# EAGLE design hd-gs-alt (EAGLE 9.6.2)
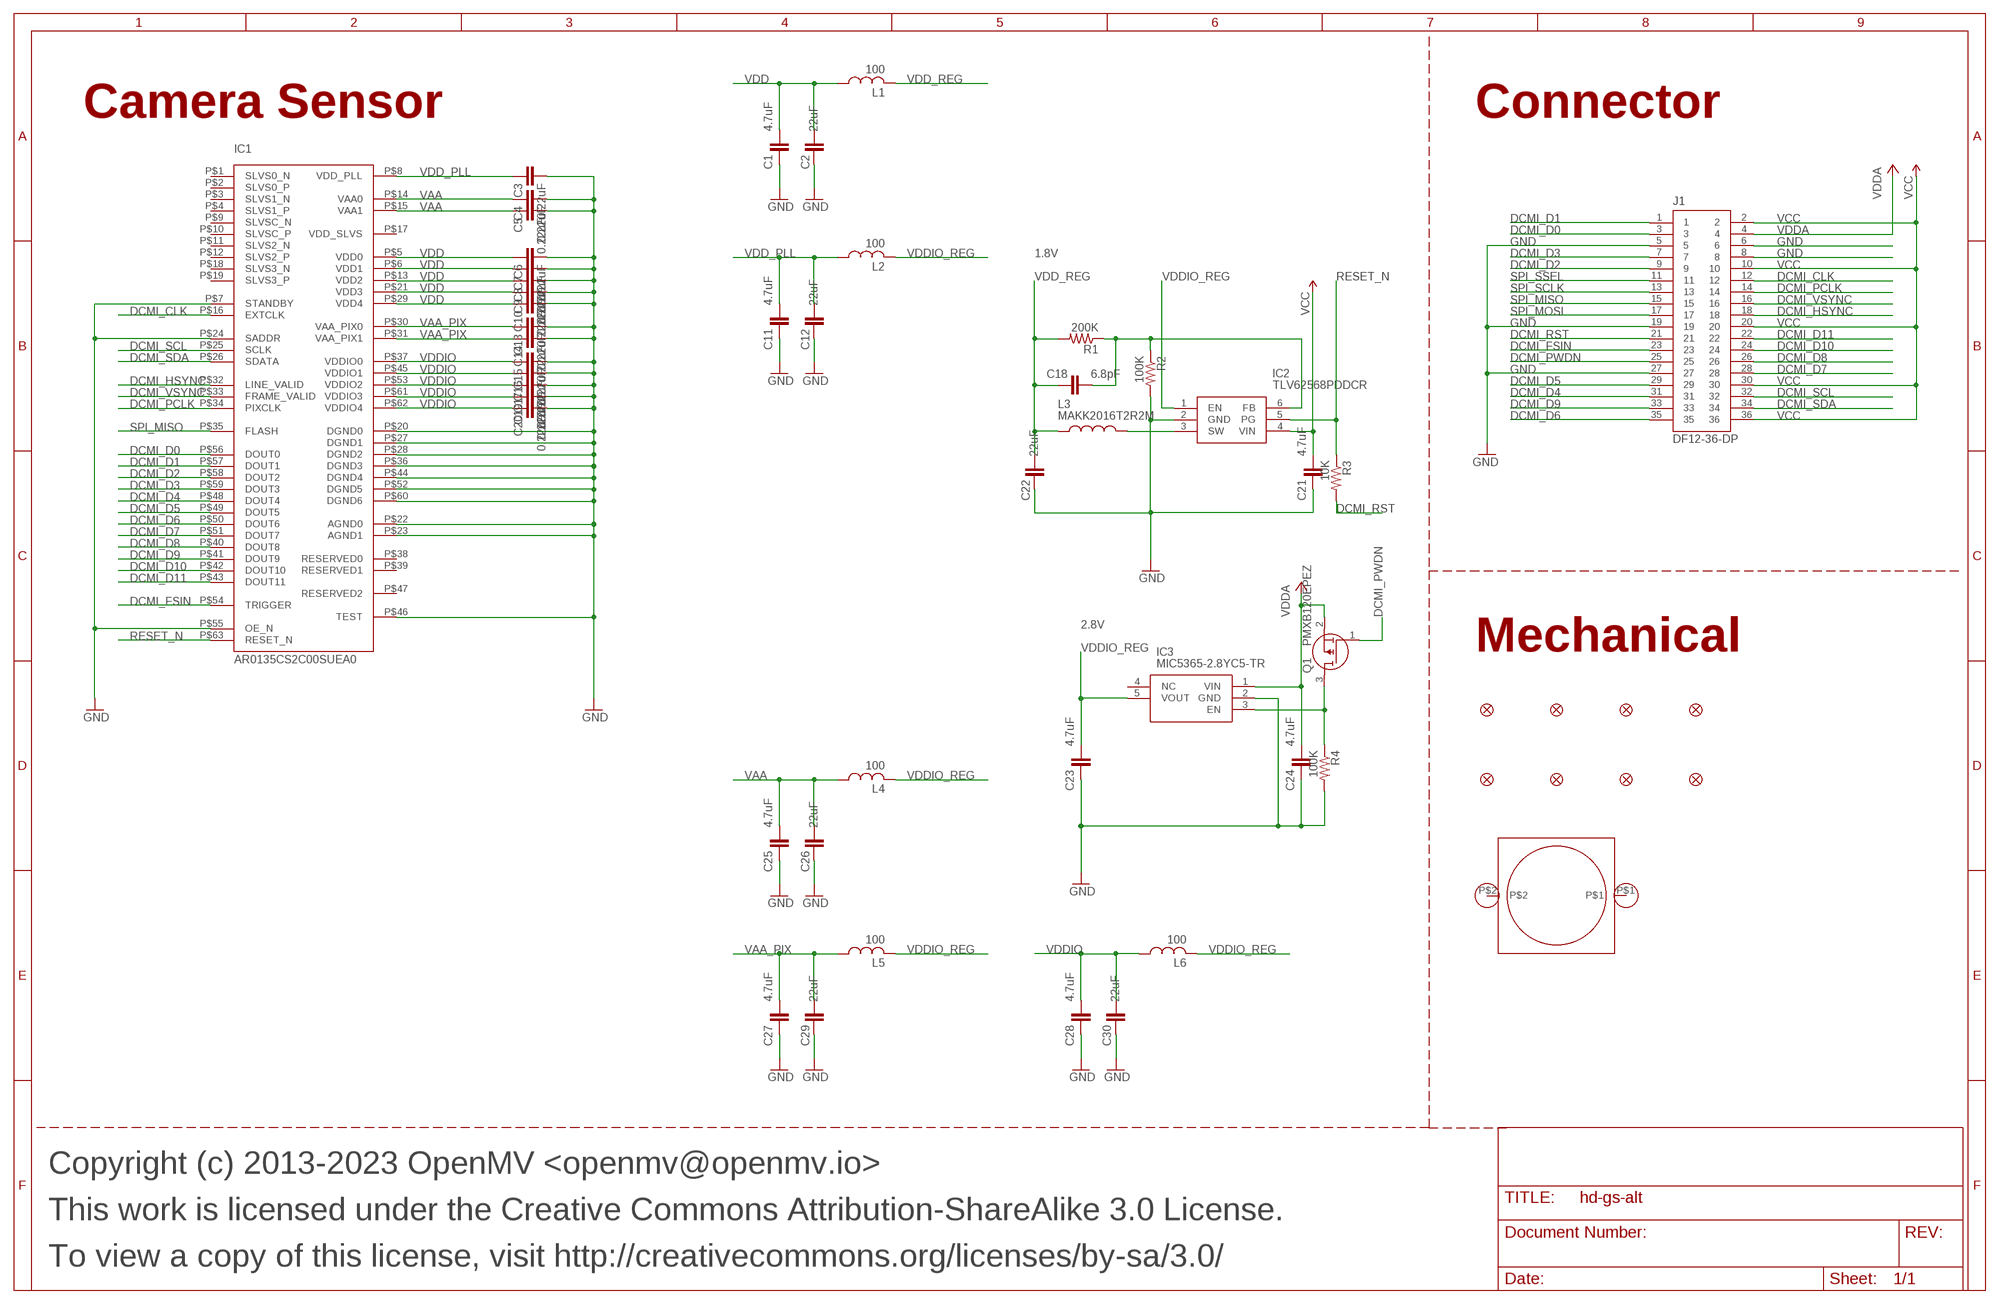
[diagram p0: schematic, sheet 1]

## Parts
C1  4.7uF  CAP_0402  [0402]
C2  22uF  22UF-0805-6.3V-20%  [0805]
C3  0.22uF  C-EUC0201  [C0201]
C4  0.22uF  C-EUC0201  [C0201]
C5  0.22uF  C-EUC0201  [C0201]
C6  0.22uF  C-EUC0201  [C0201]
C7  0.22uF  C-EUC0201  [C0201]
C8  0.22uF  C-EUC0201  [C0201]
C9  0.22uF  C-EUC0201  [C0201]
C10  0.22uF  C-EUC0201  [C0201]
C11  4.7uF  CAP_0402  [0402]
C12  22uF  22UF-0805-6.3V-20%  [0805]
C13  0.22uF  C-EUC0201  [C0201]
C14  0.22uF  C-EUC0201  [C0201]
C15  0.22uF  C-EUC0201  [C0201]
C16  0.22uF  C-EUC0201  [C0201]
C17  0.22uF  C-EUC0201  [C0201]
C18  6.8pF  CAP_0402  [0402]
C19  0.22uF  C-EUC0201  [C0201]
C20  0.22uF  C-EUC0201  [C0201]
C21  4.7uF  CAP_0402  [0402]
C22  22uF  22UF-0805-6.3V-20%  [0805]
C23  4.7uF  CAP_0402  [0402]
C24  4.7uF  CAP_0402  [0402]
C25  4.7uF  CAP_0402  [0402]
C26  22uF  22UF-0805-6.3V-20%  [0805]
C27  4.7uF  CAP_0402  [0402]
C28  4.7uF  CAP_0402  [0402]
C29  22uF  22UF-0805-6.3V-20%  [0805]
C30  22uF  22UF-0805-6.3V-20%  [0805]
FD1  FIDUCIAL1X2  [FIDUCIAL-1X2]
FD2  FIDUCIAL1X2  [FIDUCIAL-1X2]
FD3  FIDUCIAL1X2  [FIDUCIAL-1X2]
FD4  FIDUCIAL1X2  [FIDUCIAL-1X2]
FD5  FIDUCIAL1X2  [FIDUCIAL-1X2]
FD6  FIDUCIAL1X2  [FIDUCIAL-1X2]
FD7  FIDUCIAL1X2  [FIDUCIAL-1X2]
FD8  FIDUCIAL1X2  [FIDUCIAL-1X2]
H1  LENSMOUNT20MM  [LENSMOUNT-20MM]
IC1  AR0135CS2C00SUEA0  [AR0135CS2C00SUEA0]
IC2  TLV62568PDDCR  [SOT95P280X110-6N]
IC3  MIC5365-2.8YC5-TR  [SOT65P210X110-5N]
J1  DF12-36-DP  [DF12-36-DP]
L1  100  INDUCTOR_0402  [0402]
L2  100  INDUCTOR_0402  [0402]
L3  MAKK2016T2R2M  [INDC2016X100N]
L4  100  INDUCTOR_0402  [0402]
L5  100  INDUCTOR_0402  [0402]
L6  100  INDUCTOR_0402  [0402]
Q1  PMXB120EPEZ  [PMXB120EPEZ]
R1  200K  R-US_R0402  [R0402]
R2  100K  R-US_R0402  [R0402]
R3  10K  R-US_R0402  [R0402]
R4  100K  R-US_R0402  [R0402]

## Nets
DCMI_CLK [signal]: IC1.P$16(EXTCLK) J1.12
DCMI_D0 [signal]: IC1.P$56(DOUT0) J1.3
DCMI_D1 [signal]: IC1.P$57(DOUT1) J1.1
DCMI_D2 [signal]: IC1.P$58(DOUT2) J1.9
DCMI_D3 [signal]: IC1.P$59(DOUT3) J1.7
DCMI_D4 [signal]: IC1.P$48(DOUT4) J1.31
DCMI_D5 [signal]: IC1.P$49(DOUT5) J1.29
DCMI_D6 [signal]: IC1.P$50(DOUT6) J1.35
DCMI_D7 [signal]: IC1.P$51(DOUT7) J1.28
DCMI_D8 [signal]: IC1.P$40(DOUT8) J1.26
DCMI_D9 [signal]: IC1.P$41(DOUT9) J1.33
DCMI_D10 [signal]: IC1.P$42(DOUT10) J1.24
DCMI_D11 [signal]: IC1.P$43(DOUT11) J1.22
DCMI_FSIN [signal]: IC1.P$54(TRIGGER) J1.23
DCMI_HSYNC [signal]: IC1.P$32(LINE_VALID) J1.18
DCMI_PCLK [signal]: IC1.P$34(PIXCLK) J1.14
DCMI_PWDN [signal]: J1.25 Q1.1(G)
DCMI_PWDN_INT [signal]: IC3.3(EN) Q1.3(D) R4.1
DCMI_RST [signal]: J1.21 R3.2
DCMI_SCL [signal]: IC1.P$25(SCLK) J1.32
DCMI_SDA [signal]: IC1.P$26(SDATA) J1.34
DCMI_VSYNC [signal]: IC1.P$33(FRAME_VALID) J1.16
FB [pwr]: C18.2 IC2.6(FB) R1.1 R2.1
GND [gnd]: C1.1 C2.1 C3.2 C4.2 C5.2 C6.2 C7.2 C8.2 C9.2 C10.2 C11.1 C12.1 C13.2 C14.2 C15.2 C16.2 C17.2 C19.2 C20.2 C21.1 C22.1 C23.1 C24.1 C25.1 C26.1 C27.1 C28.1 C29.1 C30.1 IC1.P$7(STANDBY) IC1.P$20(DGND0) IC1.P$22(AGND0) IC1.P$23(AGND1) IC1.P$24(SADDR) IC1.P$27(DGND1) IC1.P$28(DGND2) IC1.P$36(DGND3) IC1.P$44(DGND4) IC1.P$46(TEST) IC1.P$52(DGND5) IC1.P$55(OE_N) IC1.P$60(DGND6) IC2.2(GND) IC3.2(GND) J1.5 J1.6 J1.8 J1.19 J1.27 R2.2 R4.2
RESET_N [signal]: IC1.P$63(RESET_N) IC2.5(PG) R3.1
SPI_MISO [signal]: IC1.P$35(FLASH) J1.15
SPI_MOSI [signal]: J1.17
SPI_SCLK [signal]: J1.13
SPI_SSEL [signal]: J1.11
SW [pwr]: IC2.3(SW) L3.2
VAA [pwr]: C4.1 C5.1 C25.2 C26.2 IC1.P$14(VAA0) IC1.P$15(VAA1) L4.1
VAA_PIX [pwr]: C13.1 C14.1 C27.2 C29.2 IC1.P$30(VAA_PIX0) IC1.P$31(VAA_PIX1) L5.1
VCC [pwr]: C21.2 IC2.4(VIN) J1.2 J1.10 J1.20 J1.30 J1.36
VDD [pwr]: C1.2 C2.2 C6.1 C7.1 C8.1 C9.1 C10.1 IC1.P$5(VDD0) IC1.P$6(VDD1) IC1.P$13(VDD2) IC1.P$21(VDD3) IC1.P$29(VDD4) L1.1
VDD_PLL [pwr]: C3.1 C11.2 C12.2 IC1.P$8(VDD_PLL) L2.1
VDD_REG [pwr]: C18.1 C22.2 L1.2 L3.1 R1.2
VDDA [pwr]: C24.2 IC3.1(VIN) J1.4 Q1.2(S)
VDDIO [pwr]: C15.1 C16.1 C17.1 C19.1 C20.1 C28.2 C30.2 IC1.P$37(VDDIO0) IC1.P$45(VDDIO1) IC1.P$53(VDDIO2) IC1.P$61(VDDIO3) IC1.P$62(VDDIO4) L6.1
VDDIO_REG [pwr]: C23.2 IC2.1(EN) IC3.5(VOUT) L2.2 L4.2 L5.2 L6.2
Unconnected: H1.P$1 H1.P$2 IC1.P$1(SLVS0_N) IC1.P$2(SLVS0_P) IC1.P$3(SLVS1_N) IC1.P$4(SLVS1_P) IC1.P$9(SLVSC_N) IC1.P$10(SLVSC_P) IC1.P$11(SLVS2_N) IC1.P$12(SLVS2_P) IC1.P$17(VDD_SLVS) IC1.P$18(SLVS3_N) IC1.P$19(SLVS3_P) IC1.P$38(RESERVED0) IC1.P$39(RESERVED1) IC1.P$47(RESERVED2) IC3.4(NC)

## Notes on the sheet
- Camera Sensor | Connector
- 1.8V
- 2.8V
- Mechanical
- Copyright (c) 2013-2023 OpenMV <openmv@openmv.io>
- This work is licensed under the Creative Commons Attribution-ShareAlike 3.0 License.
- To view a copy of this license, visit http://creativecommons.org/licenses/by-sa/3.0/

## Library data of the parts
C1 C11 C21 C23-C25 C27 C28 = 0402:CAP_0402: 0402 (1005 Metric) Nick Garner - TeleSense; MPN: JMK105BBJ475MV-F
C2 C12 C22 C26 C29 C30 = SparkFun-Capacitors:22UF: 22µF ceramic capacitors A capacitor is a passive two-terminal electrical component used to store electrical energy temporarily in an electric field.; MPN: CL21A226MQQNNNE; PROD_ID: CAP-08402
C3-C10 C13-C17 C19 C20 = rcl:C-EU: CAPACITOR, European symbol; MPN: GRM033R60J224ME15D; SPICEPREFIX: C
C18 = 0402:CAP_0402: 0402 (1005 Metric) Nick Garner - TeleSense; MPN: GRM1555C1H6R8DA01D
FD1-FD8 = SparkFun-Aesthetics:FIDUCIAL: Fiducial Alignment Points Point-of-reference for pick-and-place machines and other optical instruments.
H1 = lensmount:LENSMOUNT
IC1 = AR0135CS2C00SUEA0:AR0135CS2C00SUEA0; MPN: AR0135CS2C00SUEA0-DRBR
IC2 = TLV62568PDDCR:TLV62568PDDCR: 2.5V-5.5V input, 1A high efficiency step-down buck converter in SOT23 and SOT563 package Source: Datasheet <http://www.ti.com/lit/gpn/tlv62568>; DESCRIPTION: 2.5V-5.5V input, 1A high efficiency step-down buck converter in SOT23 and SOT563 package; HEIGHT: 1.1mm; MANUFACTURER_NAME: Texas Instruments; MANUFACTURER_PART_NUMBER: TLV62568PDDCR; MOUSER_PART_NUMBER: 595-TLV62568PDDCR; MOUSER_PRICE-STOCK: https://www.mouser.co.uk/ProductDetail/Texas-Instruments/TLV62568PDDCR?qs=1mbolxNpo8f1FPchIXcxyQ%3D%3D; MPN: TLV62568PDDCR
IC3 = MIC5365-2.8YC5-TR:MIC5365-2.8YC5-TR: IC REG LINEAR 2.8V 150MA SC70-5 Source: Datasheet <http://www.microchip.com/mymicrochip/filehandler.aspx?ddocname=en580022>; DESCRIPTION: IC REG LINEAR 2.8V 150MA SC70-5; HEIGHT: 1.1mm; MANUFACTURER_NAME: Microchip; MANUFACTURER_PART_NUMBER: MIC5365-2.8YC5-TR; MOUSER_PART_NUMBER: 998-MIC5365-2.8YC5TR; MOUSER_PRICE-STOCK: https://www.mouser.co.uk/ProductDetail/Microchip-Technology-Atmel/MIC5365-2.8YC5-TR?qs=U6T8BxXiZAX3mJDSWJyjVA%3D%3D; MPN: MIC5365-2.8YC5-TR
J1 = DF12NB(3.0)-36DP-0.5V(51):DF12-36-DP; MPN: DF12NB(3.0)-36DP-0.5V(51)
L1 L2 L4-L6 = 0402:INDUCTOR_0402; MPN: MFBM1V1005-101-R
L3 = MAKK2016T2R2M:MAKK2016T2R2M: INDUCTOR, METAL CORE Check availability <https://pricing.snapeda.com/parts/MAKK2016T2R2M/Taiyo%20Yuden/view-part?ref=eda>; AVAILABILITY: In Stock; DESCRIPTION: 2.2 µH Shielded Drum Core, Wirewound Inductor 1.5 A 160mOhm Max 0806 (2016 Metric); MF: Taiyo Yuden; MP: MAKK2016T2R2M; MPN: MAKK2016T2R2M; PACKAGE: 2016 Taiyo Yuden; PRICE: None; PURCHASE-URL: https://pricing.snapeda.com/search/part/MAKK2016T2R2M/?ref=eda
Q1 = PMXB120EPEZ:PMXB120EPEZ: MOSFET 30 V, P-channel Trench MOSFET Source: Datasheet <https://componentsearchengine.com/Datasheets/1/PMXB120EPEZ.pdf>; DESCRIPTION: MOSFET 30 V, P-channel Trench MOSFET; HEIGHT: 0.4mm; MANUFACTURER_NAME: Nexperia; MANUFACTURER_PART_NUMBER: PMXB120EPEZ; MOUSER_PART_NUMBER: 771-PMXB120EPEZ; MOUSER_PRICE-STOCK: https://www.mouser.co.uk/ProductDetail/Nexperia/PMXB120EPEZ?qs=gNSudQoqUYCYLaOobF3dPA%3D%3D; MPN: PMXB120EPEZ
R1 = rcl:R-US_: RESISTOR, American symbol; MPN: CRCW0402200KFKEDC; SPICEPREFIX: R
R2 R4 = rcl:R-US_: RESISTOR, American symbol; MPN: AC0402FR-07100KL; SPICEPREFIX: R
R3 = rcl:R-US_: RESISTOR, American symbol; MPN: AC0402FR-1310KL; SPICEPREFIX: R

## Net classes
0 default: width 0.076 mm, drill 0.102 mm, clearance 0.076 mm
2 gnd: width 0.076 mm, drill 0.102 mm, clearance 0.076 mm to class 0, clearance 0.076 mm to class 1, clearance 0.127 mm
3 pwr: width 0.076 mm, drill 0.102 mm, clearance 0.076 mm to class 0, clearance 0.076 mm to class 1, clearance 0.076 mm to class 2, clearance 0.127 mm
4 signal: width 0.076 mm, drill 0.102 mm, clearance 0.076 mm to class 0, clearance 0.076 mm to class 1, clearance 0.076 mm to class 2, clearance 0.076 mm to class 3, clearance 0.127 mm

## Board
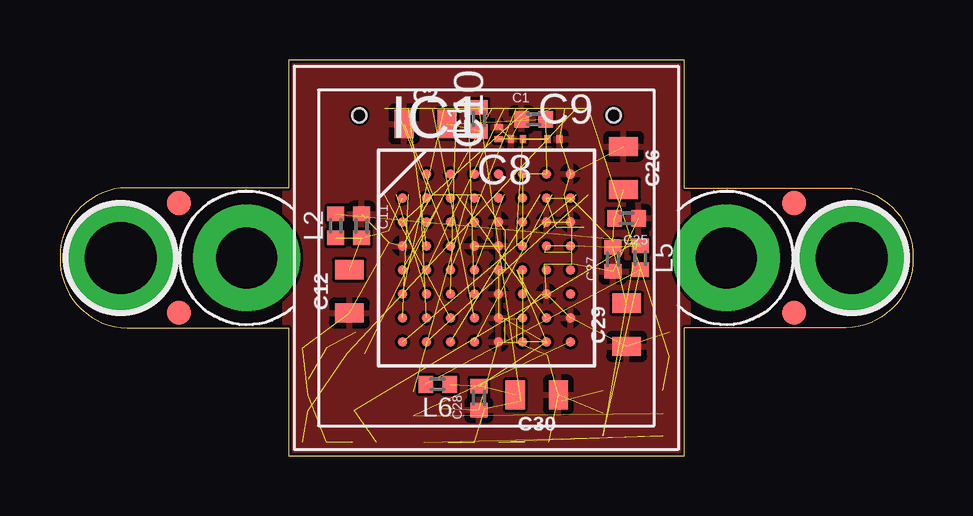
[diagram p1: board, top side]
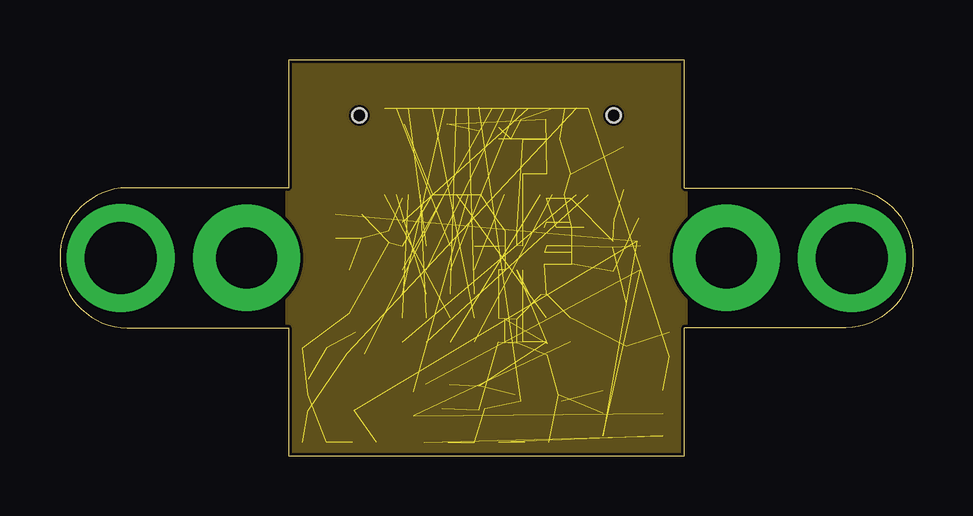
[diagram p2: board, inner layer GND]
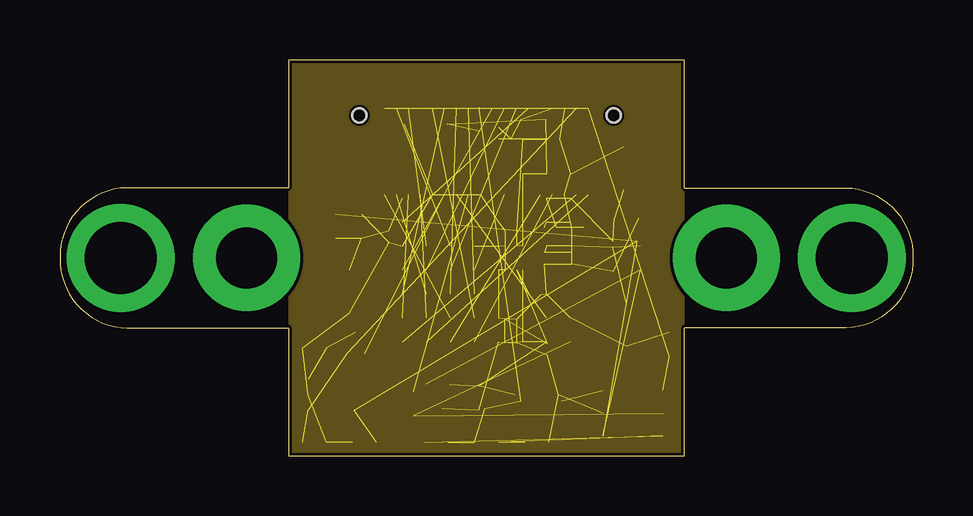
[diagram p3: board, inner layer VCC]
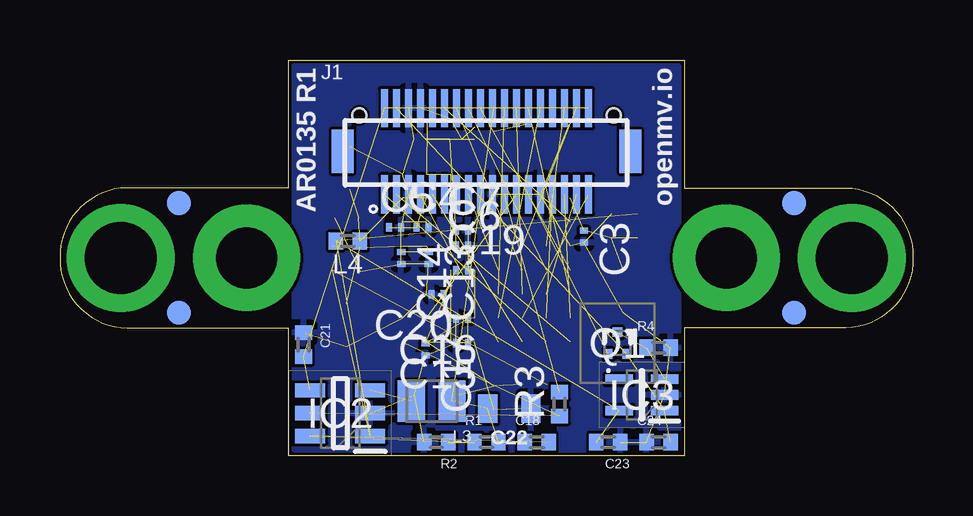
[diagram p4: board, bottom side, seen from below]

Size 35.56 x 16.51 mm. Coordinates in mm from the lower left corner, seen from the top.
Outline: 9.53,16.51 9.53,11.18 2.79,11.18 arc90 0,8.26 arc90 2.79,5.33 9.53,5.33 9.53,0 26.04,0 26.04,5.33 32.77,5.33 arc90 35.56,8.26 arc90 32.77,11.18 26.04,11.18 26.04,16.51 9.53,16.51
Copper layers (1*2*3*14*15*16): Top 0.035mm / dielectric 0.23mm / GND 0.035mm / dielectric 0.38mm / Route3 0.035mm / dielectric 0.15mm / Route14 0.035mm / dielectric 0.38mm / VCC 0.035mm / dielectric 0.23mm / Bottom 0.035mm
Design rules "MF_Ext_4_mil_drill_6_Layer": minimum track width 3mil, minimum drill 4mil, track to track 3mil, track to pad 3mil, pad to pad 3mil, via to via 3mil, smd to smd 0mil, copper to edge 3mil, drill to drill 3mil, minimum pad ring 3mil, minimum via ring 3mil, stop-mask expansion 2mil, vias tented up to drill 25mil, thermal gap 10mil
tKeepout: area 9.5,15.3 to 26,16.5; area 9.5,0 to 10.7,16.5; area 9.5,0 to 26,1.2; area 24.8,0 to 26,16.5

### Footprints (pad centres in the part's own frame; a part is rotated, then mirrored left to right if it is on the bottom)
0402 = smd 0.6 x 0.7: 1 -0.5,0; 2 0.5,0
0805 = smd 0.8 x 1.2: 1 -0.9,0; 2 0.9,0
C0201 = smd 0.25 x 0.35: 1 -0.25,0; 2 0.25,0
FIDUCIAL-1X2 = smd 1 x 1: 1 0,0
LENSMOUNT-20MM = drill 2.54 pad 4.445: P$1 -10,0; P$2 10,0
AR0135CS2C00SUEA0 = smd 0.4 x 0.4: P$1 -2.5,3.5; P$2 -1.5,3.5; P$3 -0.5,3.5; P$4 0.5,3.5; P$5 1.5,3.5; P$6 2.5,3.5; P$7 3.5,3.5; P$8 -3.5,2.5; P$9 -2.5,2.5; P$10 -1.5,2.5; P$11 -0.5,2.5; P$12 0.5,2.5; P$13 1.5,2.5; P$14 2.5,2.5; P$15 3.5,2.5; P$16 -3.5,1.5; P$17 -2.5,1.5; P$18 -1.5,1.5; P$19 -0.5,1.5; P$20 0.5,1.5; P$21 1.5,1.5; P$22 2.5,1.5; P$23 3.5,1.5; P$24 -3.5,0.5; P$25 -2.5,0.5; P$26 -1.5,0.5; P$27 -0.5,0.5; P$28 0.5,0.5; P$29 1.5,0.5; P$30 2.5,0.5; P$31 3.5,0.5; P$32 -3.5,-0.5; P$33 -2.5,-0.5; P$34 -1.5,-0.5; P$35 -0.5,-0.5; P$36 0.5,-0.5; P$37 1.5,-0.5; P$38 2.5,-0.5; P$39 3.5,-0.5; P$40 -3.5,-1.5; P$41 -2.5,-1.5; P$42 -1.5,-1.5; P$43 -0.5,-1.5; P$44 0.5,-1.5; P$45 1.5,-1.5; P$46 2.5,-1.5; P$47 3.5,-1.5; P$48 -3.5,-2.5; P$49 -2.5,-2.5; P$50 -1.5,-2.5; P$51 -0.5,-2.5; P$52 0.5,-2.5; P$53 1.5,-2.5; P$54 2.5,-2.5; P$55 3.5,-2.5; P$56 -3.5,-3.5; P$57 -2.5,-3.5; P$58 -1.5,-3.5; P$59 -0.5,-3.5; P$60 0.5,-3.5; P$61 1.5,-3.5; P$62 2.5,-3.5; P$63 3.5,-3.5
SOT95P280X110-6N = smd 1.25 x 0.6: 1 -1.25,0.95; 2 -1.25,0; 3 -1.25,-0.95; 4 1.25,-0.95; 5 1.25,0; 6 1.25,0.95
SOT65P210X110-5N = smd 1.15 x 0.4: 1 -0.95,0.65; 2 -0.95,0; 3 -0.95,-0.65; 4 0.95,-0.65; 5 0.95,0.65
DF12-36-DP = smd 0.3 x 1.6: 1 -4.25,-1.8; 2 -4.25,1.8; 3 -3.75,-1.8; 4 -3.75,1.8; 5 -3.25,-1.8; 6 -3.25,1.8; 7 -2.75,-1.8; 8 -2.75,1.8; 9 -2.25,-1.8; 10 -2.25,1.8; 11 -1.75,-1.8; 12 -1.75,1.8; 13 -1.25,-1.8; 14 -1.25,1.8; 15 -0.75,-1.8; 16 -0.75,1.8; 17 -0.25,-1.8; 18 -0.25,1.8; 19 0.25,-1.8; 20 0.25,1.8; 21 0.75,-1.8; 22 0.75,1.8; 23 1.25,-1.8; 24 1.25,1.8; 25 1.75,-1.8; 26 1.75,1.8; 27 2.25,-1.8; 28 2.25,1.8; 29 2.75,-1.8; 30 2.75,1.8; 31 3.25,-1.8; 32 3.25,1.8; 33 3.75,-1.8; 34 3.75,1.8; 35 4.25,-1.8; 36 4.25,1.8 | smd 0.9 x 1.8: F1 -6,0; F2 6,0 | hole 0.6: -5.3,1.5; 5.3,1.5
INDC2016X100N = smd 1.14 x 1.73: 1 -0.847,0; 2 0.847,0
PMXB120EPEZ = smd 0.35 x 0.4: 1 -0.375,-0.45; 2 0.375,-0.45 | smd 0.4 x 0.4: 3 0,0.45
R0402 = smd 0.6 x 0.7: 1 -0.5,0; 2 0.5,0

### Placement (x,y rotation side)
C1  19.75,14.03 0 top
C2  15.24,13.84 0 top
C3  13.72,9.14 270 bottom
C4  20.45,9.53 0 bottom
C5  21.59,9.53 0 bottom
C6  18.8,8.76 0 bottom
C7  18.8,9.4 0 bottom
C8  19.05,13.21 180 top
C9  20.57,13.21 0 top
C10  18.29,13.46 90 top
C11  12.57,9.59 270 top
C12  12.06,6.86 90 top
C13  20.19,8.26 270 bottom
C14  21.34,8.26 270 bottom
C15  18.8,4.7 180 bottom
C16  18.8,5.71 180 bottom
C17  20.32,4.45 270 bottom
C18  15.68,0.57 0 bottom
C19  18.8,7.75 0 bottom
C20  19.81,6.73 180 bottom
C21  25.4,4.64 270 bottom
C22  16.83,1.97 180 bottom
C23  12.7,0.57 180 bottom
C24  10.6,0.57 0 bottom
C25  23.62,9.91 180 top
C26  23.5,12 270 top
C27  23.05,8.19 90 top
C28  17.46,2.41 90 top
C29  23.62,5.46 90 top
C30  19.88,2.54 180 top
FD1  30.61,5.97 0 top
FD2  30.61,10.54 0 top
FD3  30.61,10.54 0 bottom
FD4  30.61,5.97 0 bottom
FD5  4.95,5.97 0 top
FD6  4.95,10.54 0 top
FD7  4.95,10.54 0 bottom
FD8  4.95,5.97 0 bottom
H1  17.78,8.26 0 top
IC1  17.78,8.26 0 top
IC2  23.88,1.78 180 bottom
IC3  11.3,2.54 180 bottom
J1  17.78,12.7 0 bottom
L1  17.46,14.03 90 top
L2  11.49,9.59 90 top
L3  20.07,2.29 180 bottom
L4  23.56,8.95 180 bottom
L5  24.19,8.26 270 top
L6  15.75,2.98 180 top
Q1  12.32,4.7 0 bottom
R1  17.78,0.57 0 bottom
R2  19.88,0.57 180 bottom
R3  14.73,2.16 90 bottom
R4  10.6,4.51 0 bottom

### Tracks (layer width: path | path; a pad name or v marks a point on that pad's centre or on a via)
DCMI_CLK  (1 unrouted)
DCMI_D0  (1 unrouted)
DCMI_D1  (1 unrouted)
DCMI_D2  (1 unrouted)
DCMI_D3  (1 unrouted)
  Bottom 0.152: J1.7 20.57,10.86
DCMI_D4  (1 unrouted)
DCMI_D5  (1 unrouted)
DCMI_D6  (1 unrouted)
DCMI_D7  (1 unrouted)
DCMI_D8  (1 unrouted)
DCMI_D9  (1 unrouted)
DCMI_D10  (1 unrouted)
DCMI_D11  (1 unrouted)
DCMI_FSIN  (1 unrouted)
DCMI_HSYNC  (1 unrouted)
DCMI_PCLK  (1 unrouted)
DCMI_PWDN  (1 unrouted)
DCMI_PWDN_INT  (2 unrouted)
DCMI_RST  (1 unrouted)
DCMI_SCL  (1 unrouted)
DCMI_SDA  (1 unrouted)
DCMI_VSYNC  (1 unrouted)
FB  (3 unrouted)
GND  (50 unrouted)
  pour GND (isolate 0.127): 9.53,0 9.53,16.51 26.04,16.51 26.04,0
  pour Top (isolate 0.127): 9.4,-0.13 9.4,16.64 26.16,16.64 26.16,-0.13
  pour Bottom (isolate 0.127): 9.78,0.25 9.78,16.26 25.78,16.26 25.78,0.25
N$3  (via drill 3 pad 4.5)
  other vias: 2.54,8.26
N$4  (via drill 3 pad 4.5)
  other vias: 33.02,8.26
RESET_N  (2 unrouted)
SPI_MISO  (1 unrouted)
SW  (1 unrouted)
VAA  (6 unrouted)
VAA_PIX  (6 unrouted)
VCC  (6 unrouted)
  Bottom 0.254: J1.20
  pour VCC (isolate 0.127): 9.65,0.13 9.65,16.38 25.91,16.38 25.91,0.13
VDD  (12 unrouted)
VDD_PLL  (4 unrouted)
VDD_REG  (4 unrouted)
VDDA  (3 unrouted)
VDDIO  (12 unrouted)
VDDIO_REG  (6 unrouted)

### Text on the board
bPlace: openmv.io | AR0135 R1